# EAGLE design soundsensor (EAGLE 9.1.0)
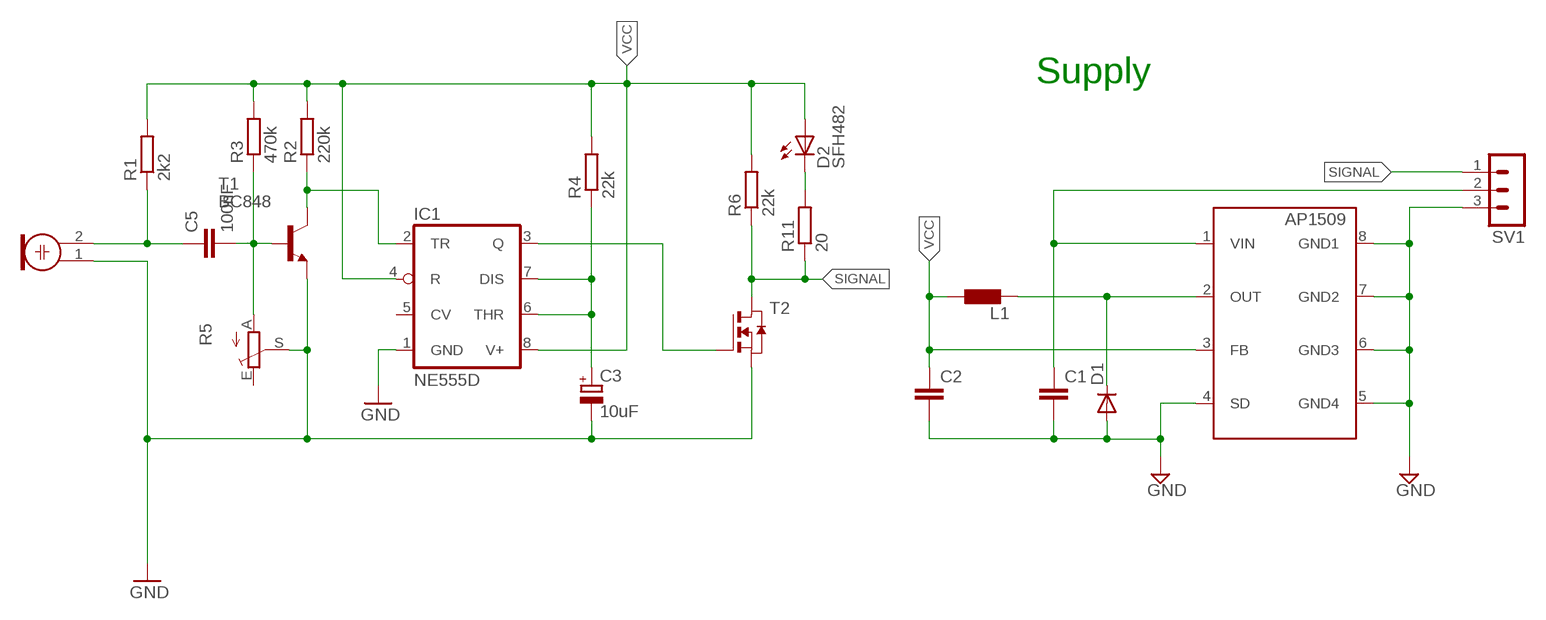
[diagram p0: schematic, sheet 1]

## Parts
C1  C-EUC1210  [C1210]
C2  C-EUC1210  [C1210]
C3  10uF  CPOL-EU150CLZ-1010  [150CLZ-1010]
C5  100nF  C-EUC0805K  [C0805K]
D1  DIODE-SOD323-W  [SOD323-W]
D2  SFH482  [SFH482]
IC1  NE555D  [SO08]
L1  LL5038P  [L5038P]
M1  ELECTRET_MICROPHON-WM-61A  [WM-61A]
R1  2k2  R-EU_M0805  [M0805]
R2  220k  R-EU_M0805  [M0805]
R3  470k  R-EU_M0805  [M0805]
R4  22k  R-EU_M0805  [M0805]
R5  TRIM_EU-CA9V  [CA9V]
R6  22k  R-EU_M0805  [M0805]
R11  20  R-EU_M0805  [M0805]
SV1  MA03-1  [MA03-1]
T1  BC848  [SOT23]
T2  NMOSSOT23  [SOT-23]
U$1  AP1509  [SOP08]

## Nets
GND: C1.2 C2.2 C3.- D1.A IC1.1(GND) M1.1 R5.S SV1.3 T1.2(E) T2.2(S) U$1.4(SD) U$1.5(GND4) U$1.6(GND3) U$1.7(GND2) U$1.8(GND1)
N$1: D2.K(C) R11.2
N$2: C1.1 SV1.2 U$1.1(VIN)
N$3: D1.C L1.2 U$1.2(OUT)
N$5: C5.1 M1.2 R1.1
N$6: C5.2 R3.1 R5.A T1.1(B)
N$7: IC1.3(Q) T2.3(G)
N$8: IC1.2(TR) R2.1 T1.3(C)
N$9: C3.+ IC1.6(THR) IC1.7(DIS) R4.1
SIGNAL: R6.1 R11.1 SV1.1 T2.1(D)
VCC: C2.1 D2.A IC1.4(R) IC1.8(V+) L1.1 R1.2 R2.2 R3.2 R4.2 R6.2 U$1.3(FB)
Unconnected: IC1.5(CV) R5.E

## Notes on the sheet
- Supply

## Library data of the parts
C1 C2 C5 = rcl:C-EU: CAPACITOR, European symbol; SPICEPREFIX: C
C3 = rcl:CPOL-EU: POLARIZED CAPACITOR, European symbol; SPICEPREFIX: C
D1 = diode:DIODE-: DIODE; TME: BAS3010A03WE6327HT
D2 = led:SFH482: IR LED infrared emitting diode, Infineon
IC1 = linear:*555: TIMER
L1 = eagle-ltspice:L: INDUCTOR, European symbol; SPICEMODEL: NONE; SPICEPREFIX: L; TME: DJNR4018-470-S
M1 = microphon:ELECTRET_MICROPHON-: Electret Condenser Microphone
R1-R4 R6 R11 = rcl:R-EU_: RESISTOR, European symbol; SPICEPREFIX: R
R5 = pot:TRIM_EU-: POTENTIOMETER
SV1 = con-lstb:MA03-1: PIN HEADER; OC_FARNELL: unknown; OC_NEWARK: unknown
T1 = transistor:BC848: NPN TRANSISTOR
T2 = zetex:NMOSSOT23: MOS FET; OC_FARNELL: unknown; OC_NEWARK: unknown
U$1 = AP1509:AP1509

## Board
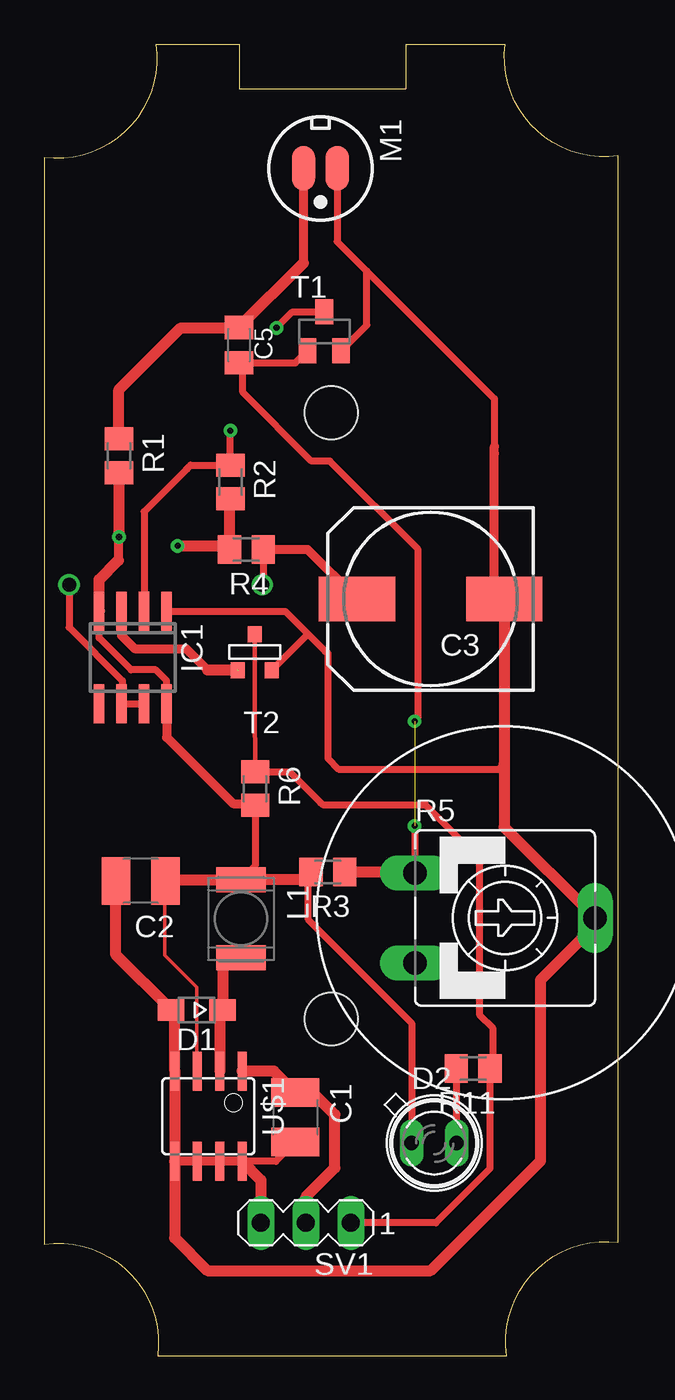
[diagram p1: board, top side]
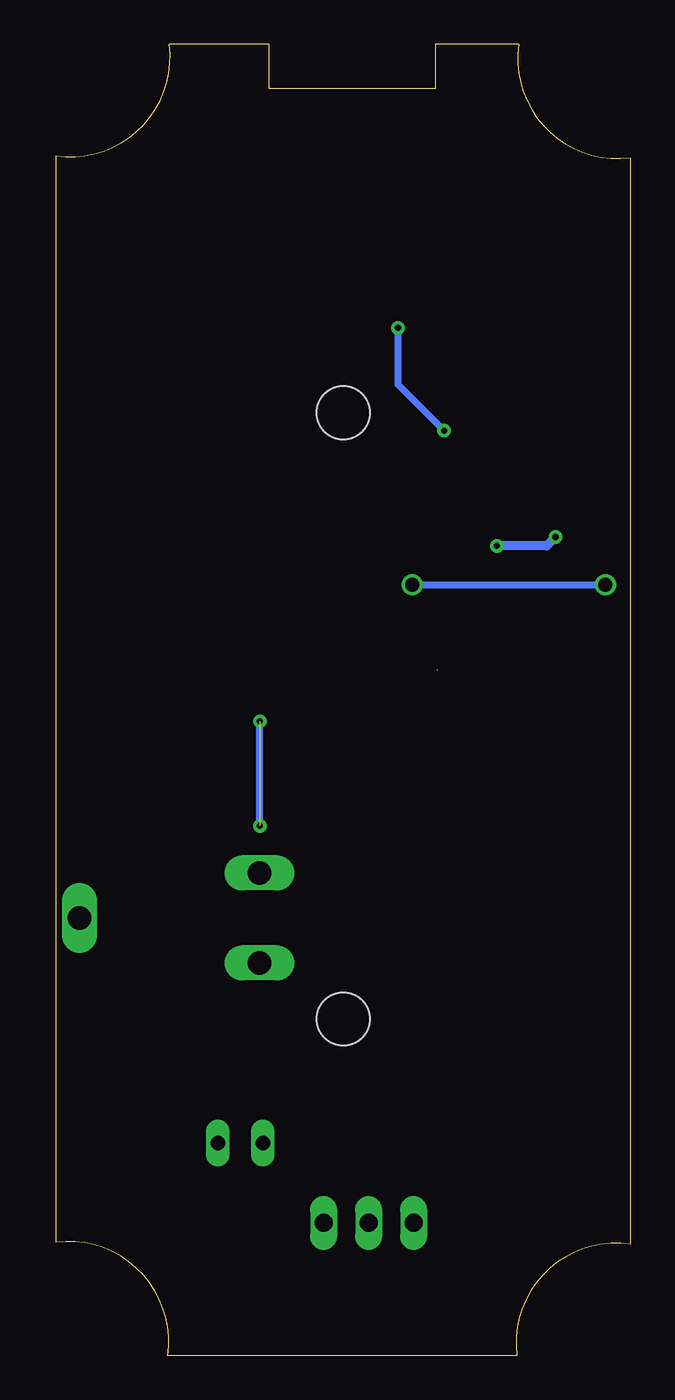
[diagram p2: board, bottom side, seen from below]

Size 32.4 x 74 mm. Coordinates in mm from the lower left corner, seen from the top.
Outline: 32.4,6.4 32.4,67.7 arc-105 26,74 20.4,74 20.4,71.5 11,71.5 11,74 6.3,74 arc-105 0,67.6 0,19.8 0,6.3 arc-105 6.4,0 26.1,0 arc-105 32.4,6.4
Copper layers (1*16): Top 0.035mm / dielectric 1.5mm / Bottom 0.035mm
Design rules "default": minimum track width 6mil, minimum drill 0.35mm, track to track 6mil, track to pad 6mil, pad to pad 6mil, via to via 6mil, smd to smd 6mil, copper to edge 40mil, drill to drill 6mil, minimum pad ring 10mil, minimum via ring 8mil, stop-mask expansion 4mil, vias tented up to drill 0mil, thermal gap 10mil
Holes 3 mm at 16.2,19 16.2,53.2

### Footprints (pad centres in the part's own frame; a part is rotated, then mirrored left to right if it is on the bottom)
C1210 = smd 1.6 x 2.7: 1 -1.4,0; 2 1.4,0
150CLZ-1010 = smd 4.3 x 2.5: + 4.15,0; - -4.15,0
C0805K = smd 1.3 x 1.6: 1 -1,0; 2 1,0
SOD323-W = smd 1.5 x 1.2: A 1.45,0; C -1.45,0
SFH482 = drill 0.813 long: A -1.27,0; K 1.27,0
SO08 = smd 0.6 x 2.2: 1 -1.905,-2.6; 2 -0.635,-2.6; 3 0.635,-2.6; 4 1.905,-2.6; 5 1.905,2.6; 6 0.635,2.6; 7 -0.635,2.6; 8 -1.905,2.6
L5038P = smd 1.4 x 2.8: 1 -2.2,0; 2 2.2,0
WM-61A = smd 2.5 x 1.3: 1 0,0.95; 2 0,-0.95
M0805 = smd 1.3 x 1.6: 1 -0.95,0; 2 0.95,0
CA9V = drill 1.321 long: A -2.54,-5.08; E 2.54,-5.08; S 0,5.08
MA03-1 = drill 1.016 long: 1 -2.54,0; 2 0,0; 3 2.54,0
SOT23 = smd 1 x 1.4: 1 -0.95,-1.1; 2 0.95,-1.1; 3 0,1.1
SOT-23 = smd 0.787 x 0.889: 1 0.025,-1.016; 2 -0.94,1.016; 3 0.991,1.016
SOP08 = smd 0.5 x 2.2: 1 -1.905,-2.9; 2 -0.645,-2.9; 3 0.625,-2.9; 4 1.895,-2.9; 5 1.905,2.2; 6 0.635,2.2; 7 -0.635,2.2; 8 -1.905,2.2

### Placement (x,y rotation side)
C1  14.16,13.45 270 top
C2  5.44,26.79 180 top
C3  21.8,42.7 180 top
C5  10.98,57.02 270 top
D1  8.6,19.51 180 top
D2  22,12 0 top
IC1  5,39.4 180 top
L1  11.1,24.65 270 top
M1  15.58,67 270 top
R1  4.21,50.78 270 top
R2  10.5,49.3 270 top
R3  16,27.3 180 top
R4  11.4,45.5 180 top
R5  26,24.7 270 top
R6  11.9,32 270 top
R11  24.2,16.2 180 top
SV1  14.76,7.49 180 top
T1  15.8,57.8 0 top
T2  11.9,39.7 180 top
U$1  9.26,13.16 180 top

### Tracks (layer width: path | path; a pad name or v marks a point on that pad's centre or on a via)
GND
  Top 0.406: 7.4,16.6 7.37,16.6 7.37,16.3 U$1.4 7.37,15.8 7.37,10.96 U$1.5 | C1.2 14.05,11.95 13.07,10.96 U$1.8 | IC1.1 13.6,42 14.9,40.7 | 14.9,40.7 15.85,39.75 | 15.85,39.75 16,39.6 | T2.2 14.86,40.7 14.9,40.7 | 15.85,39.75 arc-90 16,39.6 | 16,39.6 16,33.7 16.6,33.1 25.65,33.1 25.95,33.4 | M1.1 16.53,62.87 18.2,61.2 | 18.2,61.2 25.4,54 25.4,50.9 | T1.2 18.2,58.15 18.2,61.2
  Top 0.508: U$1.8 U$1.7 U$1.6 7.5,10.96 U$1.5 | C3.- 25.4,43.25 25.4,50.9 25.4,51.3
  Top 0.61: D1.A 4.04,22.62 C2.2 4.32,27.07 | D1.A 7.57,19.09 | 7.5,10.96 7.37,11.1 U$1.4 7.37,19.3 arc90 D1.A | U$1.8 12.22,9.9 SV1.3 | 26.5,42.15 C3.- | C3.- 25.95,43 25.9,43 25,42.1 | 30.94,24.84 R5.S | U$1.5 7.36,6.64 9.2,4.8 21.8,4.8 28,11 28,21.2 31,24.2 31,24.62 R5.S 30.94,24.84 | C3.- 25.95,33.4 25.95,29.83 30.94,24.84
N$1
  Top 0.406: R11.2 23.25,12.02 D2.K
N$2
  Top 0.61: SV1.2 14.76,8.96 16.4,10.6 16.4,13.6 15.15,14.85 C1.1 12.95,16.06 U$1.1
N$3
  Top 0.406: L1.2 11.01,22.36 10.45,22.36 10.3,22.5 10.11,22.3
  Top 0.61: 10.11,22.3 10.11,19.57 D1.C arc90 9.9,19.36 U$1.2
N$5
  Top 0.508: 14.63,61.67 M1.2
  Top 0.61: 14.63,61.67 C5.1 10.96,58 7.7,58 4.21,54.51 R1.1 4.3,51.82
N$6  (via drill 0.35)  (1 unrouted)
  Top 0.203: 20.92,29.48 20.9,29.5 v20.9,29.9 | v20.9,35.8 arc90 21.1,36
  Top 0.406: R5.A 20.92,29.48 | 21.1,36 21.1,39.48 21.1,45.5 16.12,50.48 15.07,50.48 11.2,54.35 11.2,55.8 C5.2 14.17,56.02 T1.1
  Top 0.508: C5.2 11,56
  Top 0.61: R3.1 17.3,27.3 20.86,27.3 R5.A
  Bottom 0.406: v20.9,29.9 v20.9,35.8
N$7  (1 unrouted)
  Top 0.508: IC1.3 4.37,40.63 5.1,39.9 8,39.9 8.75,39.15 9.2,38.7
  Top 0.61: 9.2,38.7 10.89,38.7
N$8  (via drill 0.35)
  Top 0.406: IC1.2 5.63,47.63 8,50 8.1,50.1 8.25,50.25 R2.1 v10.5,52.2 | v10.5,52.2 10.5,52.3 v10.5,52.2 | v13.1,58 14,58.9 T1.3
  Bottom 0.406: v10.5,52.2 13.1,54.8 v13.1,58
N$9  (via drill 0.8)
  Top 0.406: IC1.7 IC1.6 4.4,36.84 4.4,38.1 1.4,41.1 v1.4,43.5 | R4.1 12.35,43.55 v12.3,43.5
  Top 0.508: R4.1 14.85,45.5 C3.+
  Bottom 0.406: v12.3,43.5 v1.4,43.5
SIGNAL
  Top 0.254: T2.1 11.88,36.83 11.86,36.81 R6.1
  Top 0.406: R6.1 13.85,32.95 15.6,31.2 | 15.6,31.2 15.58,31.18 | 24.55,28.05 24.7,27.9 | 24.55,28.05 24.55,21.2 | 24.55,21.2 24.55,21.05 | 24.55,21.2 24.55,19.25 25.3,18.5 25.3,16.35 R11.1 25.15,10.55 22.09,7.49 SV1.1 | 15.6,31.2 15.7,31.1 21.5,31.1 24.55,28.05
VCC  (via drill 0.35)
  Top 0.2: U$1.3 8.6,16.09 8.6,20.8 6.8,22.6 6.8,26.75 C2.1
  Top 0.254: U$1.3 8.63,15.23 | 14.9,27.15 R3.2
  Top 0.406: IC1.8 6.91,38.09 6.3,38.7 4.9,38.7 3.1,40.5 IC1.4 3.11,42.02 | 14.9,27.15 14.9,24.6 20.6,18.9 20.73,18.77 D2.A | R6.2 11.9,27.65 L1.1
  Top 0.508: IC1.8 6.91,34.9 10.65,31.15 11.8,31.15 R6.2 | 4.18,44.88 4.21,44.91 v4.21,46.2 | v4.21,46.2 4.21,46.6 | 4.21,46.23 v4.21,46.2
  Top 0.61: C2.1 6.9,26.85 L1.1 11.9,26.85 14.6,26.85 arc90 R3.2 | 3.11,42.02 IC1.4 3.1,43.8 4.18,44.88 | R2.2 arc90 10.45,48.3 10.45,45.7 | 10.45,45.7 R4.2 | v7.52,45.7 10.45,45.7 | R1.2 4.21,46.6 4.21,46.23
  Bottom 0.508: v4.21,46.2 4.71,45.7 v7.52,45.7